# Altium schematic sheet shield.SchDoc
size 420 x 297 mm; SheetNumber: 1; SheetTotal: 1
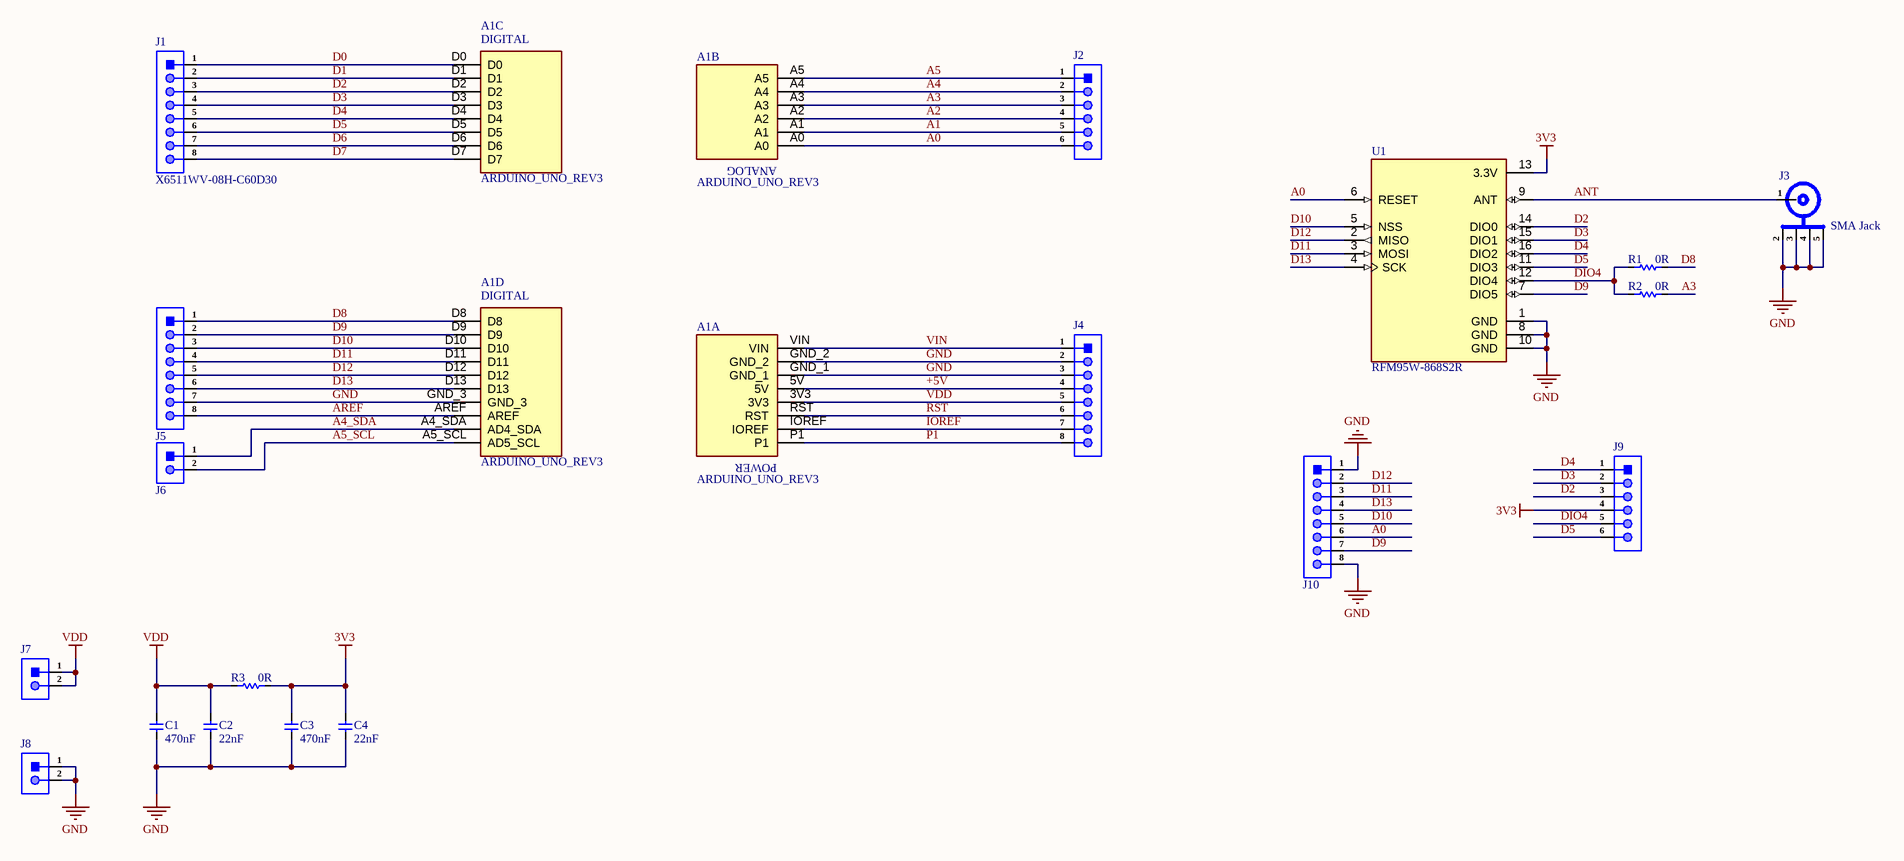
[diagram p0: shield.SchDoc]

## Parts
A1  ARDUINO_UNO_REV3  [ARDUINO_ARDUINO_UNO_REV3]  (parts A,B,C,D of 4)
C1  470nF  [Cap-0402]
C2  22nF  [Cap-0402]
C3  470nF  [Cap-0402]
C4  22nF  [Cap-0402]
J1  X6511WV-08H-C60D30  [HDR 1x8 TH male]
J2  X6511WV-06H-C60D30  [HDR1X6_]  (value not drawn)
J3  SMA Jack  [CON-SMA-EDGE_S]
J4  X6511WV-08H-C60D30  [HDR 1x8 TH male]  (value not drawn)
J5  X6511WV-08H-C60D30  [HDR 1x8 TH male]  (value not drawn)
J6  X6511WV-02H-C60D30  [HDR1X2_]  (value not drawn)
J7  X6511WV-02H-C60D30  [HDR1X2_]  (value not drawn)
J8  X6511WV-02H-C60D30  [HDR1X2_]  (value not drawn)
J9  X6511WV-06H-C60D30  [HDR1X6_]  (value not drawn)
J10  X6511WV-08H-C60D30  [HDR 1x8 TH male]  (value not drawn)
R1  0R  [Res-0603]
R2  0R  [Res-0603]
R3  0R  [Res-0603]
U1  RFM95W-868S2R  [MODULE_RFM95W-868S2R]

## Nets
3V3: C3.2 C4.2 J9.4 R3.2 U1.13(3.3V)
GND: A1.GND_1 A1.GND_2 A1.GND_3 C1.1 C2.1 C3.1 C4.1 J3.2(GND) J3.3(GND) J3.4(GND) J3.5(GND) J4.2 J4.3 J5.7 J8.1 J8.2 J10.1 J10.8 U1.1(GND) U1.8(GND) U1.10(GND)
VDD: A1.3V3 C1.2 C2.2 J4.5 J7.1 J7.2 R3.1
+5V: A1.5V J4.4
A0: A1.A0 J2.6 J10.6 U1.6(RESET)
A1: A1.A1 J2.5
A2: A1.A2 J2.4
A3: A1.A3 J2.3 R2.2
A4: A1.A4 J2.2
A4_SDA: A1.A4_SDA(AD4_SDA) J6.1
A5: A1.A5 J2.1
A5_SCL: A1.A5_SCL(AD5_SCL) J6.2
ANT: J3.1(ANT) U1.9(ANT)
AREF: A1.AREF J5.8
D0: A1.D0 J1.1
D1: A1.D1 J1.2
D2: A1.D2 J1.3 J9.3 U1.14(DIO0)
D3: A1.D3 J1.4 J9.2 U1.15(DIO1)
D4: A1.D4 J1.5 J9.1 U1.16(DIO2)
D5: A1.D5 J1.6 J9.6 U1.11(DIO3)
D6: A1.D6 J1.7
D7: A1.D7 J1.8
D8: A1.D8 J5.1 R1.2
D9: A1.D9 J5.2 J10.7 U1.7(DIO5)
D10: A1.D10 J5.3 J10.5 U1.5(NSS)
D11: A1.D11 J5.4 J10.3 U1.3(MOSI)
D12: A1.D12 J5.5 J10.2 U1.2(MISO)
D13: A1.D13 J5.6 J10.4 U1.4(SCK)
DIO4: J9.5 R1.1 R2.1 U1.12(DIO4)
IOREF: A1.IOREF J4.7
P1: A1.P1 J4.8
RST: A1.RST J4.6
VIN: A1.VIN J4.1

## Notes on the sheet
- PROJECT
- TITLE
- SCALE:
- A3
- SIZE
- FILE NAME
- SHEET
- OF
- REV
- (in symbol ARDUINO_UNO_REV3, part A) POWER
- (in symbol ARDUINO_UNO_REV3, part B) ANALOG
- (in symbol ARDUINO_UNO_REV3, part C) DIGITAL
- (in symbol ARDUINO_UNO_REV3, part D) DIGITAL

## Library data of the parts
A1 = ARDUINO_UNO_REV3: Microcontroller board based on the ATmega328P.; MP: ARDUINO UNO REV3; SnapEDA_Link: https://www.snapeda.com/parts/ARDUINO%20UNO%20REV3/Arduino/view-part/?ref=snap; Package: Non-Standard Arduino; Value: *; MF: Arduino; Check_prices: https://www.snapeda.com/parts/ARDUINO%20UNO%20REV3/Arduino/view-part/?ref=eda
C1 C3 = CC0402KRX5R7BB474: CAP CER 0.47UF 16V X5R 0402; Manufacturer: Yageo; Tolerance: 10%; Item Type: Capacitor; Supplier 1: Future Electronics; Manufacturer Part Number: CC0402KRX5R7BB474; RoHS: Yes; Category: Ceramic Capacitors; Stock 1: 10000; Pricing 1: 10000=0.01840, 20000=0.01800, 40000=0.01760, 50000=0.01750, 150000=0.01670 (USD); Mount: Surface Mount; Case/Package: 0402; Min Operating Temperature: -55°C; Max Operating Temperature: 85°C; Capacitance: 470nF; Packaging: Tape and Reel; Voltage Rating: 16V; Voltage Rating (DC): 16V; Length: 0.039inch; Width: 0.02inch; Thickness: 0.022inch; Lead Free: Lead Free; Halogen Free: Halogen Free; RoHS Compliant: Yes; ComponentLink1URL: http://www.yageo.com/documents/recent/UPY-GPHC_X5R_4V-to-50V_25.pdf?src-supplier=Digi-Key; ComponentLink1Description: http://www.yageo.com/documents/recent/UPY-GPHC_X5R_4V-to-50V_25.pdf?src-supplier=Digi-Key; ComponentLink2URL: http://www.yageo.com/exep/pages/download/literatures/ProductSelectionGuide%202014_Final_2.pdf?src-supplier=Digi-Key; ComponentLink2Description: http://www.yageo.com/exep/pages/download/literatures/ProductSelectionGuide%202014_Final_2.pdf?src-supplier=Digi-Key; Supplier Part Number 1: 1070400; LCSC Part Number: C527010
C2 C4 = CC0402JRX7R7BB223: CAP CER 0.022UF 16V X7R 0402; Manufacturer: Yageo; Tolerance: 5%; Item Type: Capacitor; Supplier: Digikey; Supplier Part Number: 311-3758-1-ND; Manufacturer Part Number: CC0402JRX7R7BB223; RoHS: Yes; Category: Ceramic Capacitors; Stock: 4203; Pricing: 1=0.1, 10=0.033, 50=0.0192, 100=0.0149, 500=0.0112, 1000=0.0088, 2500=0.008, 5000=0.00736 (USD); Mounting Technology: Surface Mount; Case/Package: 0402; Case Code (Imperial): 0402; Case Code (Metric): 1005; Weight: 2.3E-05oz; Min Operating Temperature: -55°C; Max Operating Temperature: 125°C; Value: 22nF; Packaging: Tape and Reel; Voltage Rating: 16V; Voltage Rating (DC): 16V; Dielectric: X7R; Termination: SMD/SMT; Series: CC; Length: 0.039inch; Width: 0.5mm; Thickness: 0.022inch; RoHS Compliant: Yes; Halogen Free: 5694HalogenFree; Lead Free: 5697LeadFree; ComponentLink1URL: https://datasheet.ciiva.com/13264/upy-gphc-x7r-6-3v-to-50v-8-12304-13264039.pdf?src-supplier=Mouser; ComponentLink1Description: https://datasheet.ciiva.com/13264/upy-gphc-x7r-6-3v-to-50v-8-12304-13264039.pdf?src-supplier=Mouser; LCSC Part Number: C541459
J1 J4 J5 J10 = X6511WV-08H-C60D30: Gold 250V 3A Square Pins 2.5mm 8P 260℃ 6mm -40℃~+105℃ 3mm 2.54mm Plugin Black Brass 2.54mm 1x8P Plugin,P=2.54mm Pin Headers ROHS; Manufacturer: XKB; Item Type: Male Header; Manufacturer Part Number: X6511WV-08H-C60D30; Package: Plugin,P=2.54mm; LCSC Part Number: C706880; ComponentLink1Description: LCSC; ComponentLink1URL: https://www.lcsc.com/product-detail/Pin-Headers_XKB-Connection-X6511WV-08H-C60D30_C706880.html
J2 J9 = X6511WV-06H-C60D30: Gold 250V 3A Straight Square Pins 2.5mm 6P 260℃ 6mm -40℃~+105℃ 3mm 2.54mm Plugin Black Brass 1x6P Plugin,P=2.54mm Pin Headers ROHS; Manufacturer: XKB; Item Type: Male Header; Manufacturer Part Number: X6511WV-06H-C60D30; Package: Plugin,P=2.54mm; LCSC Part Number: C706878; ComponentLink1Description: LCSC; ComponentLink1URL: https://www.lcsc.com/product-detail/Pin-Headers_XKB-Connectivity-X6511WV-06H-C60D30_C706878.html
J3 = CON-SMA-EDGE-S: Sma Female Connector, Pcb Edge Mount Rohs Compliant: Yes; Manufacturer: RF Solutions; Number of Ports: 1; Supplier 1: Rs; Manufacturer Part Number: CON-SMA-EDGE-S; RoHS: Yes; Category: RF / Coaxial Connectors; Stock 1: 4145; Pricing 1: 1=1.16, 10=0.96 (GBP); Mount: Edge,Board; Case/Package: SMA; Connector Type: SMA; Fastening Type: Threaded; Termination: Solder; Series: -; ComponentLink1URL: https://media.digikey.com/pdf/Data%20Sheets/RF%20Solutions%20PDFs/CON-SMA-EDGE.pdf?src-supplier=Digi-Key; ComponentLink1Description: https://media.digikey.com/pdf/Data%20Sheets/RF%20Solutions%20PDFs/CON-SMA-EDGE.pdf?src-supplier=Digi-Key; Package: THT; Item Type: Connector; Supplier Part Number 1: 1258191
J6-J8 = X6511WV-02H-C60D30: Gold 250V 3A Straight Square Pins 2.5mm 2P 260℃ 6mm -40℃~+105℃ 3mm 2.54mm Plugin Black Brass 1x2P Plugin,P=2.54mm Pin Headers ROHS; Manufacturer: XKB; Item Type: Male Header; Manufacturer Part Number: X6511WV-02H-C60D30; Package: Plugin,P=2.54mm; LCSC Part Number: C706874; ComponentLink1Description: LCSC; ComponentLink1URL: https://www.lcsc.com/product-detail/Pin-Headers_XKB-Connectivity-X6511WV-02H-C60D30_C706874.html
R1-R3 = RC0603FR-070RL: RES SMD 0R, 1%, 0.1W, 0603; Manufacturer: Yageo; Item Type: Resistor; Manufacturer Part Number: RC0603FR-070RL; Package: 0603; LCSC Part Number: C100044; ComponentLink9Description: LCSC; ComponentLink9URL: https://www.lcsc.com/product-detail/Chip-Resistor-Surface-Mount_YAGEO-RC0603FR-070RL_C100044.html
U1 = RFM95W-868S2R: Module: transceiver; RF; FSK,GFSK,GMSK,LoRa,MSK,OOK; 868MHz; SMD; MF: Hope Microelectronics; SnapEDA_Link: https://www.snapeda.com/parts/RFM95W-868S2R/HOPE+Microelectronics/view-part/?ref=snap; Package: None; Value: *; MP: RFM95W-868S2R; Check_prices: https://www.snapeda.com/parts/RFM95W-868S2R/HOPE+Microelectronics/view-part/?ref=eda